# EAGLE schematic ProjectIOT (EAGLE 9.7.0)
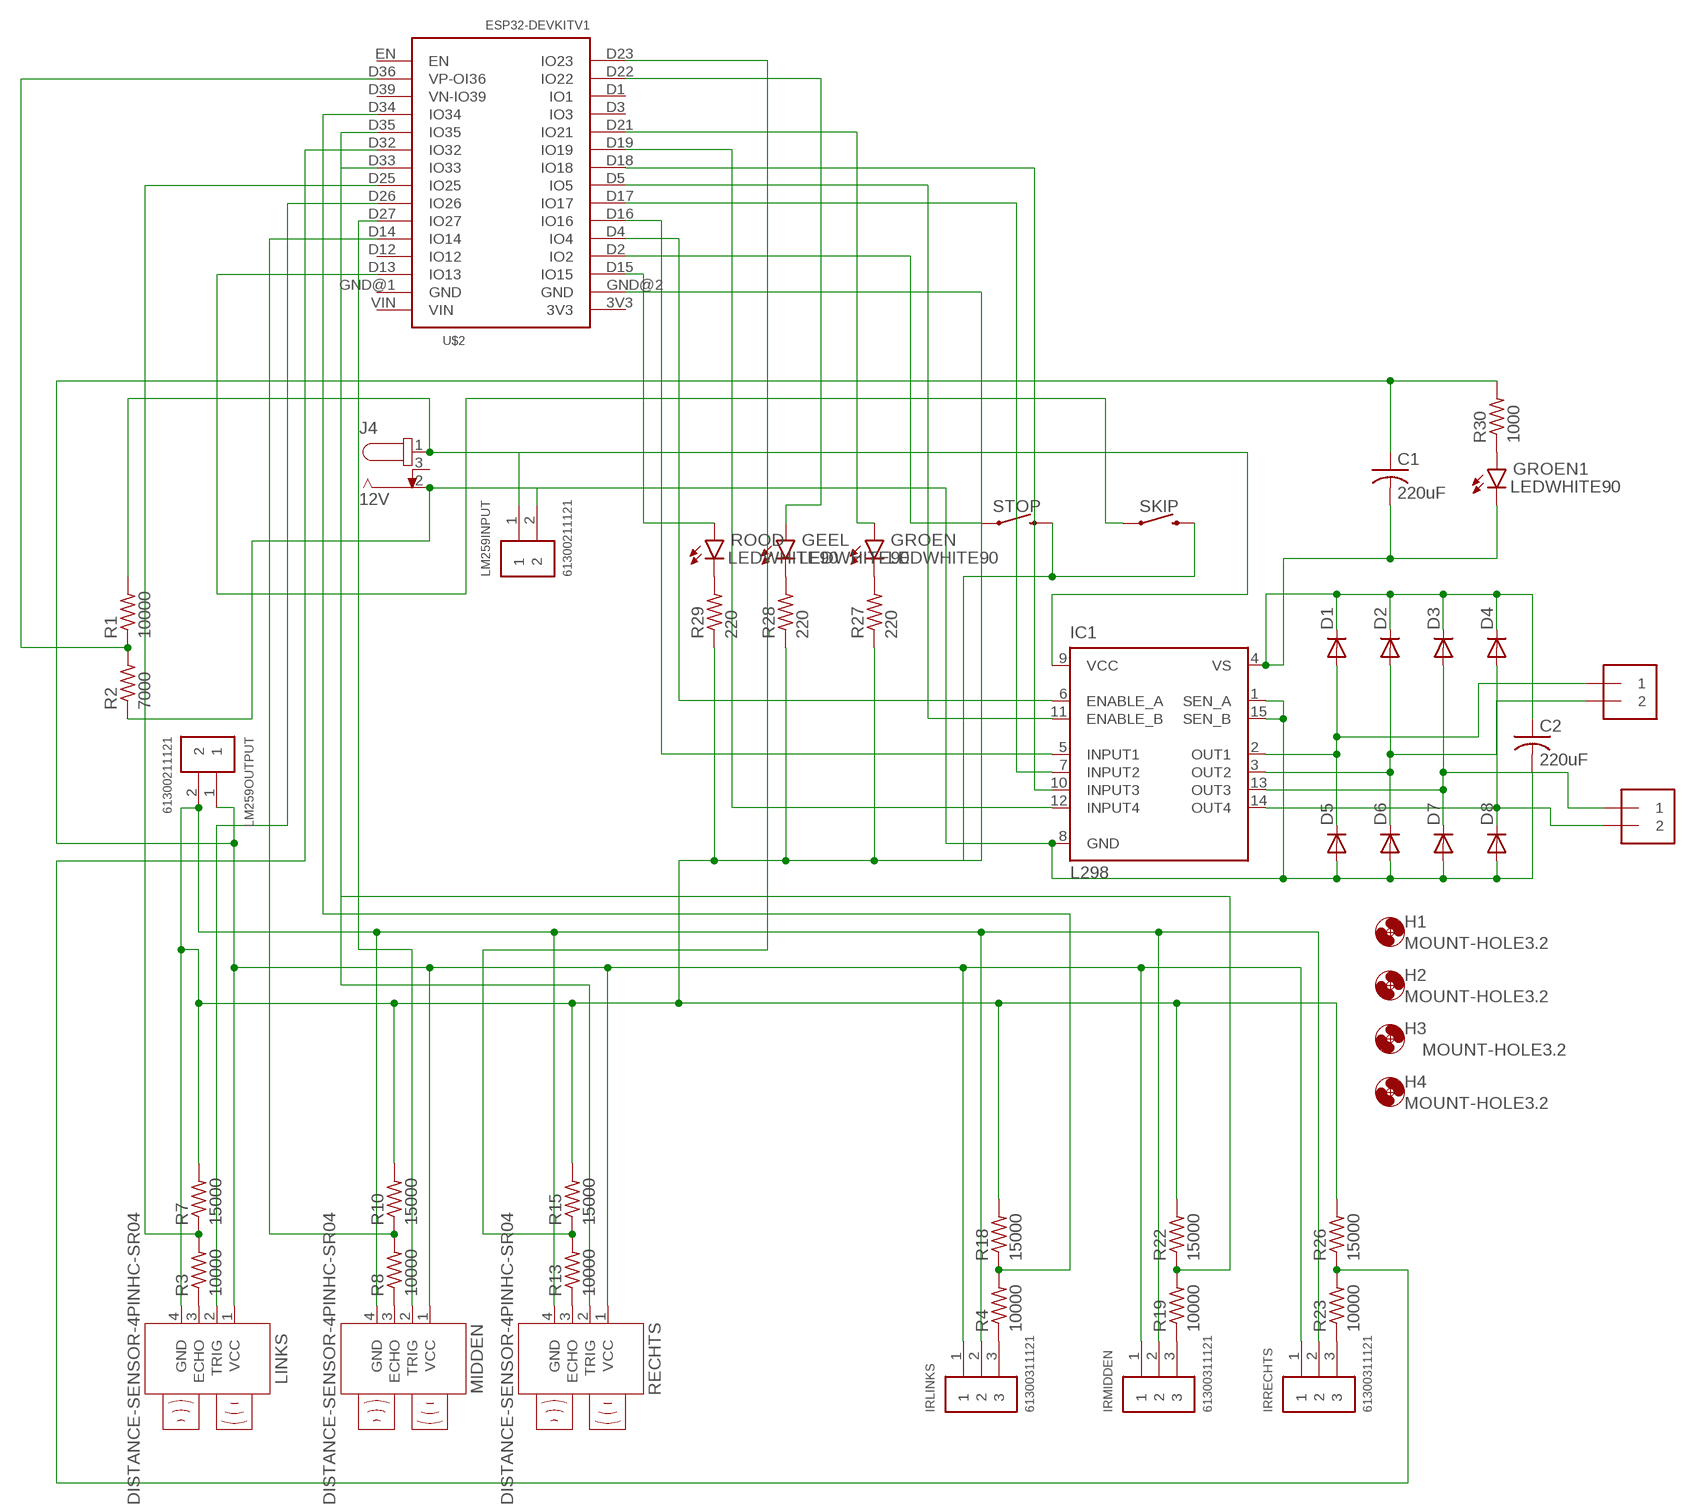
[diagram p0: schematic, sheet 1]

## Parts
C1  220uF  C-US050-024X044  [C050-024X044]
C2  220uF  C-US050-024X044  [C050-024X044]
D1  DIODE-D-5  [D-5]
D2  DIODE-D-5  [D-5]
D3  DIODE-D-5  [D-5]
D4  DIODE-D-5  [D-5]
D5  DIODE-D-5  [D-5]
D6  DIODE-D-5  [D-5]
D7  DIODE-D-5  [D-5]
D8  DIODE-D-5  [D-5]
GEEL  LEDWHITE90  [LEDRD254W60D565H860B_W90]
GROEN  LEDWHITE90  [LEDRD254W60D565H860B_W90]
GROEN1  LEDWHITE90  [LEDRD254W60D565H860B_W90]
H1  MOUNT-HOLE3.2  [3,2]
H2  MOUNT-HOLE3.2  [3,2]
H3  MOUNT-HOLE3.2  [3,2]
H4  MOUNT-HOLE3.2  [3,2]
IC1  L298  [MULTIWATT-15]
IRLINKS  61300311121  [61300311121]
IRMIDDEN  61300311121  [61300311121]
IRRECHTS  61300311121  [61300311121]
J4  12V  694103303002  [694103303002]
LINKS  DISTANCE-SENSOR-4PINHC-SR04  [HC-SR04]
LM259INPUT  61300211121  [61300211121]
LM259OUTPUT  61300211121  [61300211121]
MIDDEN  DISTANCE-SENSOR-4PINHC-SR04  [HC-SR04]
MOTORA  1X2-3.5MM  [1X2-3.5MM]
MOTORB  1X2-3.5MM  [1X2-3.5MM]
R1  10000  R-US_0204/2V  [0204V]
R2  7000  R-US_0204/2V  [0204V]
R3  10000  R-US_0204/2V  [0204V]
R4  10000  R-US_0204/2V  [0204V]
R7  15000  R-US_0204/2V  [0204V]
R8  10000  R-US_0204/2V  [0204V]
R10  15000  R-US_0204/2V  [0204V]
R13  10000  R-US_0204/2V  [0204V]
R15  15000  R-US_0204/2V  [0204V]
R18  15000  R-US_0204/2V  [0204V]
R19  10000  R-US_0204/2V  [0204V]
R22  15000  R-US_0204/2V  [0204V]
R23  10000  R-US_0204/2V  [0204V]
R26  15000  R-US_0204/2V  [0204V]
R27  220  R-US_0204/2V  [0204V]
R28  220  R-US_0204/2V  [0204V]
R29  220  R-US_0204/2V  [0204V]
R30  1000  R-US_0204/2V  [0204V]
RECHTS  DISTANCE-SENSOR-4PINHC-SR04  [HC-SR04]
ROOD  LEDWHITE90  [LEDRD254W60D565H860B_W90]
SKIP  MOMENTARY-SWITCH-SPST-PTH-6.0MM  [TACTILE_SWITCH_PTH_6.0MM]
STOP  MOMENTARY-SWITCH-SPST-PTH-6.0MM  [TACTILE_SWITCH_PTH_6.0MM]
U$2  ESP32DEVKITV1  [ESP32-DEVKITV1]

## Nets
N$1: IC1.9(VCC) J4.1 LM259INPUT.1 R1.2
N$2: C2.2 D5.A D6.A D7.A D8.A IC1.1(SEN_A) IC1.8(GND) IC1.15(SEN_B) J4.2 LM259INPUT.2 R2.1
N$4: D1.A D5.C IC1.2(OUT1) MOTORA.1
N$5: D2.A D6.C IC1.3(OUT2) MOTORA.2
N$6: D3.A D7.C IC1.13(OUT3) MOTORB.1
N$7: D4.A D8.C IC1.14(OUT4) MOTORB.2
N$8: IC1.5(INPUT1) U$2.D16(IO16)
N$9: IC1.7(INPUT2) U$2.D17(IO17)
N$10: IC1.6(ENABLE_A) U$2.D4(IO4)
N$11: IC1.10(INPUT3) U$2.D18(IO18)
N$12: IC1.12(INPUT4) U$2.D19(IO19)
N$13: IC1.11(ENABLE_B) U$2.D5(IO5)
N$14: R1.1 R2.2 U$2.D36(VP-OI36)
N$15: LINKS.3(ECHO) R3.1
N$16: R3.2 R7.1 U$2.D25(IO25)
N$17: R8.2 R10.1 U$2.D14(IO14)
N$20: MIDDEN.3(ECHO) R8.1
N$21: R13.2 R15.1 U$2.D23(IO23)
N$22: IRLINKS.3 R4.1
N$25: R13.1 RECHTS.3(ECHO)
N$30: R4.2 R18.1 U$2.D34(IO34)
N$31: IRMIDDEN.3 R19.1
N$34: R19.2 R22.1 U$2.D35(IO35)
N$35: IRRECHTS.3 R23.1
N$38: R23.2 R26.1 U$2.D32(IO32)
N$40: MIDDEN.2(TRIG) U$2.D27(IO27)
N$41: C1.1 IRLINKS.1 IRMIDDEN.1 IRRECHTS.1 LINKS.1(VCC) LM259OUTPUT.1 MIDDEN.1(VCC) R30.2 RECHTS.1(VCC)
N$42: GROEN.2(C) R27.2
N$43: GEEL.2(C) R28.2
N$44: R29.2 ROOD.2(C)
N$45: IRLINKS.2 IRMIDDEN.2 IRRECHTS.2 LINKS.4(GND) LM259OUTPUT.2 MIDDEN.4(GND) R7.2 R10.2 R15.2 R18.2 R22.2 R26.2 R27.1 R28.1 R29.1 RECHTS.4(GND) SKIP.3 STOP.3 U$2.GND@2(GND)
N$46: ROOD.1(A) U$2.D15(IO15)
N$47: GEEL.1(A) U$2.D22(IO22)
N$48: GROEN.1(A) U$2.D21(IO21)
N$49: STOP.1 U$2.D2(IO2)
N$50: SKIP.1 U$2.D13(IO13)
N$51: LINKS.2(TRIG) U$2.D26(IO26)
N$52: RECHTS.2(TRIG) U$2.D33(IO33)
N$53: GROEN1.1(A) R30.1
N$54: C1.2 C2.1 D1.C D2.C D3.C D4.C GROEN1.2(C) IC1.4(VS)
Unconnected: J4.3 U$2.3V3 U$2.D1(IO1) U$2.D3(IO3) U$2.D12(IO12) U$2.D39(VN-IO39) U$2.EN U$2.GND@1(GND) U$2.VIN

## Library data of the parts
C1 C2 = rcl:C-US: CAPACITOR, American symbol
D1-D8 = diode:DIODE-: DIODE
GEEL GROEN GROEN1 ROOD = LED Flashlight Component Library:LED: Radial LED (Round), 2.54 mm pitch, 5.65 mm body diameter, 8.60 mm body height Radial LED (Round) package with 2.54 mm pitch (lead spacing), 0.60 mm lead width, 0.50 mm lead thickness, 5.65 mm body diameter and 8.60 mm body height
H1-H4 = holes:MOUNT-HOLE: MOUNTING HOLE with drill center marker
IC1 = st-microelectronics:L298: DUAL FULL-BRIDGE DRIVER
IRLINKS IRMIDDEN IRRECHTS = Headers:61300311121: CONN HEADER VERT 3POS 2.54MM Manufacturer's datasheet <https://katalog.we-online.de/em/datasheet/6130xx11121.pdf>
J4 = DC Power Jacks:694103303002: CONN PWR JACK 1.05X3.5MM SOLDER Manufacturer's datasheet <https://katalog.we-online.de/em/datasheet/6941xx303002.pdf>
LINKS MIDDEN RECHTS = Tinkercad:DISTANCE-SENSOR-4PIN
LM259INPUT LM259OUTPUT = Headers:61300211121: CONN HEADER VERT 2POS 2.54MM Manufacturer's datasheet <https://katalog.we-online.de/em/datasheet/6130xx11121.pdf>
MOTORA MOTORB = adafruit:1X2: 3.5mm Terminal block http://www.ladyada.net/library/pcb/eaglelibrary.html
R1-R4 R7 R8 R10 R13 R15 R18 R19 R22 R23 R26-R30 = BeagleBone_Black_Wireless:R-US_: RESISTOR, American symbol
SKIP STOP = SparkFun-Switches:MOMENTARY-SWITCH-SPST: Momentary Switch (Pushbutton) - SPST Normally-open (NO) SPST momentary switches (buttons, pushbuttons). Variants PTH-12MM - 12mm square, through-hole Momentary Pushbutton Switch - 12mm Square <https://www.sparkfun.com/products/9190> (COM-09190) PTH-6.0MM, PTH-6.0MM-KIT - 6.0mm square, through-hole Mini Pushbutton Switch <https://www.sparkfun.com/products/97> (COM-00097) KIT package intended for soldering kit's - only one side of pads' copper is exposed. PTH-RIGHT-ANGLE-KIT - Right-angle, through-hole Right Angle Tactile Button <https://www.sparkfun.com/products/10791> - Used on SparkFun BigTime Watch Kit <https://www.sparkfun.com/products/11734> SMD-12MM - 12mm square, surface-mount Tactile Button - SMD (12mm) <https://www.sparkfun.com/products/12993> (COM-12993) Used on SparkFun PicoBoard <https://www.sparkfun.com/products/11888> SMD-4.5MM - 4.5mm Square Trackball Switch Used on SparkFun Blackberry Trackballer Breakout <https://www.sparkfun.com/products/13169> SMD-4.6MMX2.8MM - 4.60mm x 2.80mm, surface mount Used on SparkFun Pro Micro - RP2040 <https://www.sparkfun.com/products/17717> SMD-5.2MM, SMD-5.2-REDUNDANT - 5.2mm square, surface-mount Mini Pushbutton Switch - SMD <https://www.sparkfun.com/products/8720> (COM-08720) Used on Arduino Pro Mini <https://www.sparkfun.com/products/11114> REDUNDANT package connects both switch circuits together SMD-6.0X3.5MM - 6.0 x 3.5mm, surface mount Momentary Reset Switch SMD <https://www.sparkfun.com/products/8229> (COM-08229) SMD-6.2MM-TALL - 6.2mm square, surface mount Tactile Button - SMD (6mm) <https://www.sparkfun.com/products/12992> Used on SparkFun Digital Sandbox <https://www.sparkfun.com/products/12651> SMD-RIGHT-ANGLE - Right-angle, surface mount Used on SparkFun Block for Intel® Edison - Arduino <https://www.sparkfun.com/products/13036>
U$2 = ESP32-DEVKITV1:ESP32DEVKITV1